# EAGLE design Kegboardv2.0 (EAGLE 5.03)
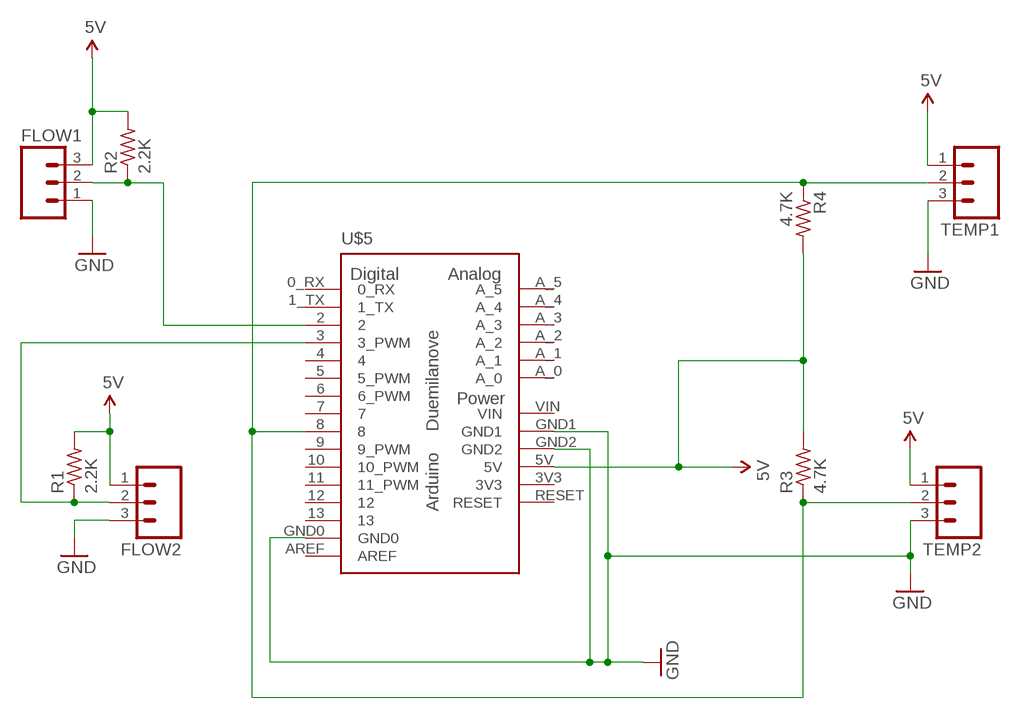
[diagram p0: schematic, sheet 1]

## Parts
FLOW1  M03LOCK_LONGPADS  [1X03_LOCK_LONGPADS]
FLOW2  M03LOCK_LONGPADS  [1X03_LOCK_LONGPADS]
R1  2.2K  R-US_0204/2V  [0204V]
R2  2.2K  R-US_0204/2V  [0204V]
R3  4.7K  R-US_0204/2V  [0204V]
R4  4.7K  R-US_0204/2V  [0204V]
TEMP1  M03LOCK_LONGPADS  [1X03_LOCK_LONGPADS]
TEMP2  M03LOCK_LONGPADS  [1X03_LOCK_LONGPADS]
U$5  ARDUINO-USBLONG_PADS_TEXT  [SHIELD]

## Nets
5V: FLOW1.3 FLOW2.1 R1.2 R2.2 R3.2 R4.2 TEMP1.1 TEMP2.1 U$5.5V
GND: FLOW1.1 FLOW2.3 TEMP1.3 TEMP2.3 U$5.GND0 U$5.GND1 U$5.GND2
N$4: R3.1 R4.1 TEMP1.2 TEMP2.2 U$5.8
N$5: FLOW2.2 R1.1 U$5.3(3_PWM)
N$6: FLOW1.2 R2.1 U$5.2
Unconnected: U$5.0_RX U$5.1_TX U$5.4 U$5.5(5_PWM) U$5.6(6_PWM) U$5.7 U$5.9(9_PWM) U$5.10(10_PWM) U$5.11(11_PWM) U$5.12 U$5.13 U$5.A_0 U$5.A_1 U$5.A_2 U$5.A_3 U$5.A_4 U$5.A_5 U$5.AREF U$5.RESET

## Power pins joined to a net without a drawn wire
3V3: U$5.3V3
VIN: U$5.VIN

## Library data of the parts
FLOW1 FLOW2 TEMP1 TEMP2 = SparkFun:M03: Header 3 Standard 3-pin 0.1" header. Use with straight break away headers (SKU : PRT-00116), right angle break away headers (PRT-00553), swiss pins (PRT-00743), machine pins (PRT-00117), and female headers (PRT-00115). Molex polarized connector foot print use with SKU : PRT-08232 with associated crimp pins and housings.
R1-R4 = resistor:R-US_: RESISTOR, American symbol
U$5 = Arduino-Various-edited:ARDUINO-USB: The Ardiuno Duemilanove Pinouts layoutet as a Bare Shield. v0.5 Also for Arduino Diecimila. This is designed as a Part and has no Outline in the Dimension Layer. The Outline, when present, is drawed at the tPlace / bPlace Layer. Library by Stephanie Lange, http://www.k-ita.de/~sl/

## Board
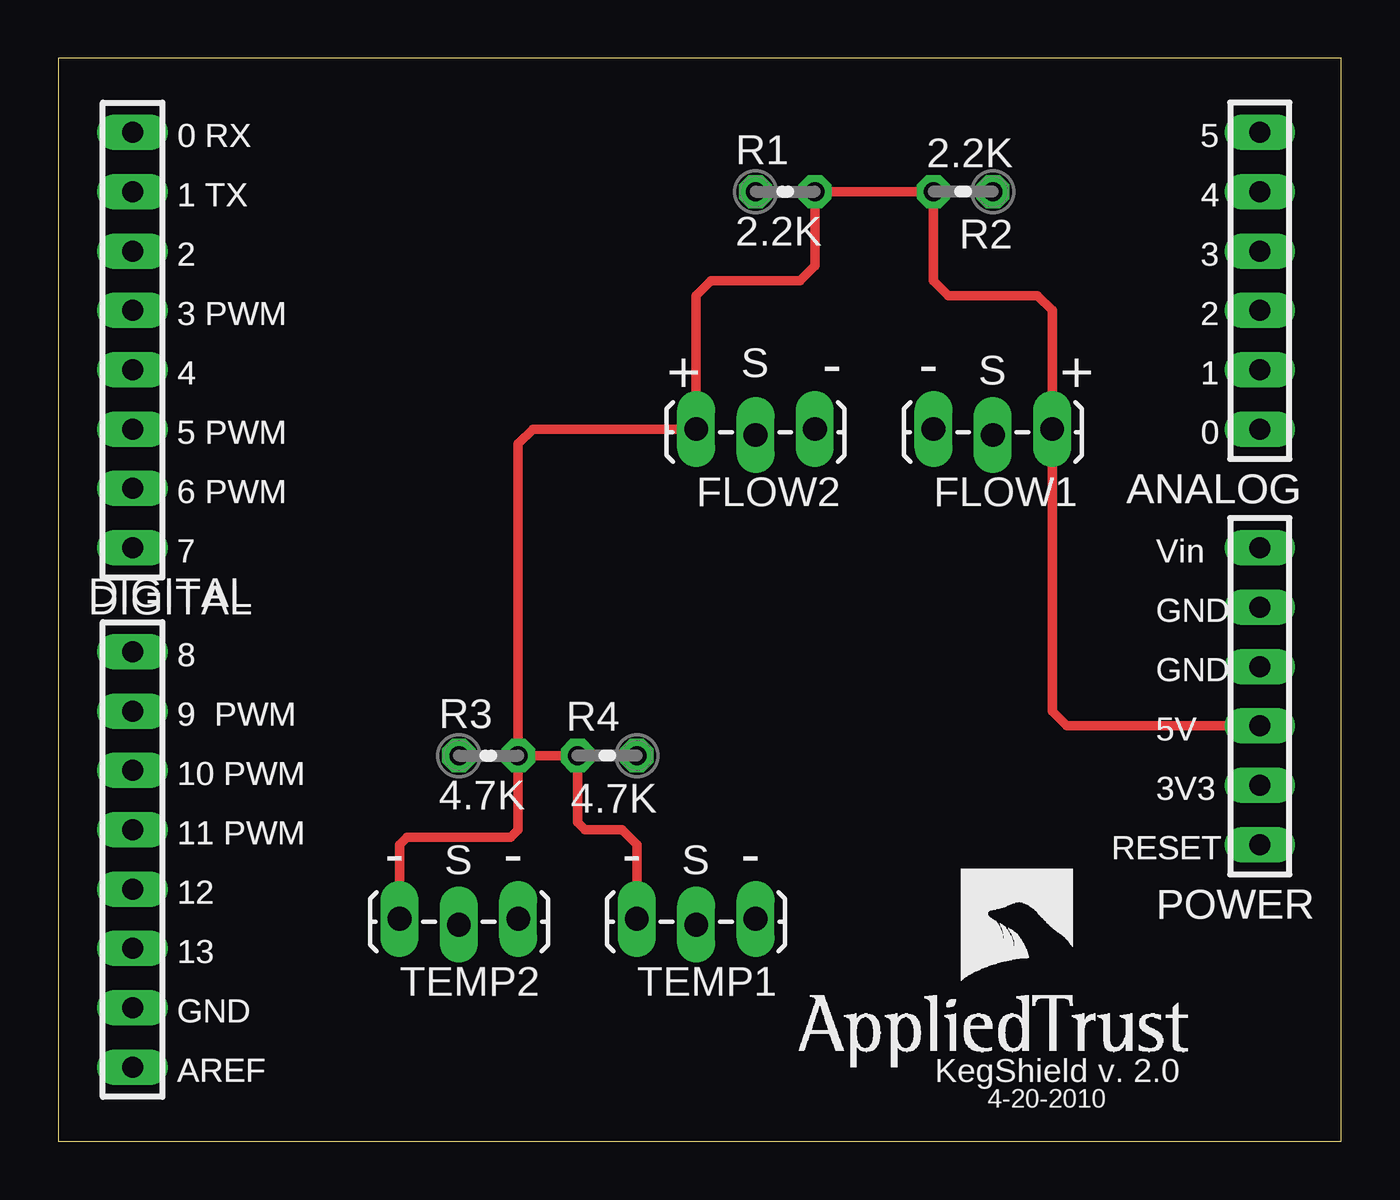
[diagram p1: board, top side]
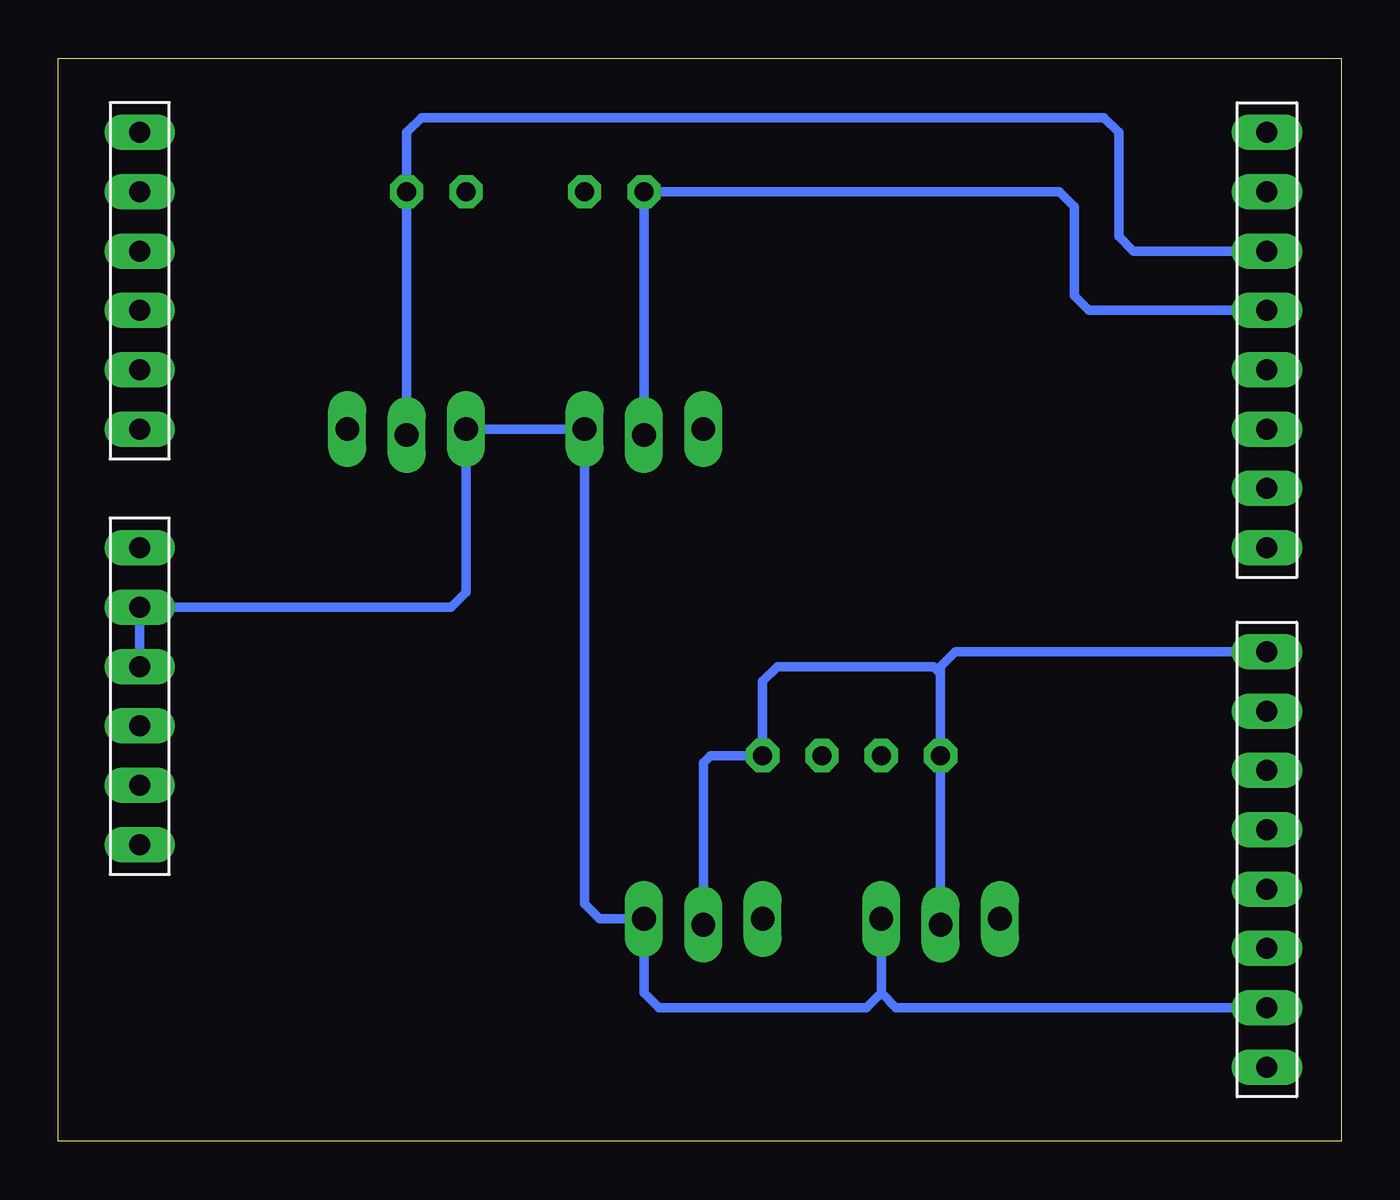
[diagram p2: board, bottom side, seen from below]

Size 54.91 x 46.34 mm. Coordinates in mm from the lower left corner, seen from the top.
Outline: 0,0 54.92,0 54.92,46.35 0,46.35 0,0
Copper layers (1*16): Top 0.035mm / dielectric 1.5mm / Bottom 0.035mm
Design rules "SparkFun": minimum track width 8mil, minimum drill 20mil, track to track 8mil, track to pad 8mil, pad to pad 8mil, via to via 8mil, smd to smd 8mil, copper to edge 10mil, drill to drill 8mil, minimum pad ring 12mil, minimum via ring 10mil, stop-mask expansion 4mil, vias tented up to drill 25mil, thermal gap 10mil

### Footprints (pad centres in the part's own frame; a part is rotated, then mirrored left to right if it is on the bottom)
1X03_LOCK_LONGPADS = drill 1.016 long: 1 0,0; 2 2.54,-0.254; 3 5.08,0
0204V = drill 0.813 octagon: 1 -1.27,0; 2 1.27,0
SHIELD = drill 0.9 pad 1.27 long: 0_RX -25.4,27.94; 1_TX -25.4,25.4; 2 -25.4,22.86; 3 -25.4,20.32; 3V3 22.86,0; 4 -25.4,17.78; 5 -25.4,15.24; 5V 22.86,2.54; 6 -25.4,12.7; 7 -25.4,10.16; 8 -25.4,5.715; 9 -25.4,3.175; 10 -25.4,0.635; 11 -25.4,-1.905; 12 -25.4,-4.445; 13 -25.4,-6.985; A_0 22.86,15.24; A_1 22.86,17.78; A_2 22.86,20.32; A_3 22.86,22.86; A_4 22.86,25.4; A_5 22.86,27.94; AREF -25.4,-12.065; GND0 -25.4,-9.525; GND1 22.86,7.62; GND2 22.86,5.08; RESET 22.86,-2.54; VIN 22.86,10.16

### Placement (x,y rotation side)
FLOW1  37.46,30.48 0 top
FLOW2  27.3,30.48 0 top
R1  31.12,40.64 0 top
R2  38.73,40.64 180 top
R3  18.42,16.51 0 top
R4  23.5,16.51 180 top
TEMP1  24.77,9.52 0 top
TEMP2  14.6,9.52 0 top
U$5  28.58,15.24 0 top

### Tracks (layer width: path | path; a pad name or v marks a point on that pad's centre or on a via)
5V
  Top 0.406: U$5.5V 43.18,17.78 42.54,18.42 FLOW1.3 42.54,35.56 41.91,36.2 38.1,36.2 37.46,36.83 R2.2 R1.2 32.39,37.47 31.75,36.83 27.94,36.83 27.3,36.2 FLOW2.1 20.32,30.48 19.69,29.85 R3.2 | R3.2 R4.2 22.23,13.65 22.54,13.34 24.13,13.34 24.76,12.7 TEMP1.1 | TEMP2.1 14.6,12.7 14.92,13.02 19.37,13.02 19.69,13.34 R3.2
GND
  Bottom 0.406: 19.69,6.35 19.05,5.72 U$5.GND0 | 19.69,6.35 TEMP2.3 | 19.69,6.35 20.32,5.72 29.21,5.72 29.85,6.35 TEMP1.3 31.75,9.53 32.39,10.16 FLOW2.3 FLOW1.1 37.46,23.5 38.1,22.86 U$5.GND1 U$5.GND2
N$4
  Bottom 0.406: U$5.8 16.51,20.96 17.14,20.32 17.14,20 | 17.14,20 R3.1 TEMP2.2 | TEMP1.2 27.3,16.19 26.99,16.51 R4.1 24.76,19.69 24.13,20.32 17.46,20.32 17.14,20
N$5
  Bottom 0.406: FLOW2.2 R1.1 12.07,40.64 11.43,40.01 11.43,36.2 10.8,35.56 U$5.3
N$6
  Bottom 0.406: FLOW1.2 R2.1 40,43.18 39.37,43.82 10.16,43.82 9.52,43.18 9.52,38.74 8.89,38.1 U$5.2

### Text on the board
tPlace: 0 RX | 5 | 1 TX | 4 | 2 | 3 | 3 PWM | 2 | S | 4 | + | - | - | S | + | 1 | 5 PWM | 0 | 6 PWM | ANALOG | 7 | Vin | DIGITAL | GND | 8 | GND | 9 PWM | 5V | 10 PWM | 3V3 | 11 PWM | RESET | - | S | - | - | S | - | 12 | POWER | 13 | GND | AREF | KegShield v. 2.0 | 4-20-2010